# Altium schematic sheet Control.SchDoc
size 406 x 304 mm; SheetNumber: 4; SheetTotal: 8
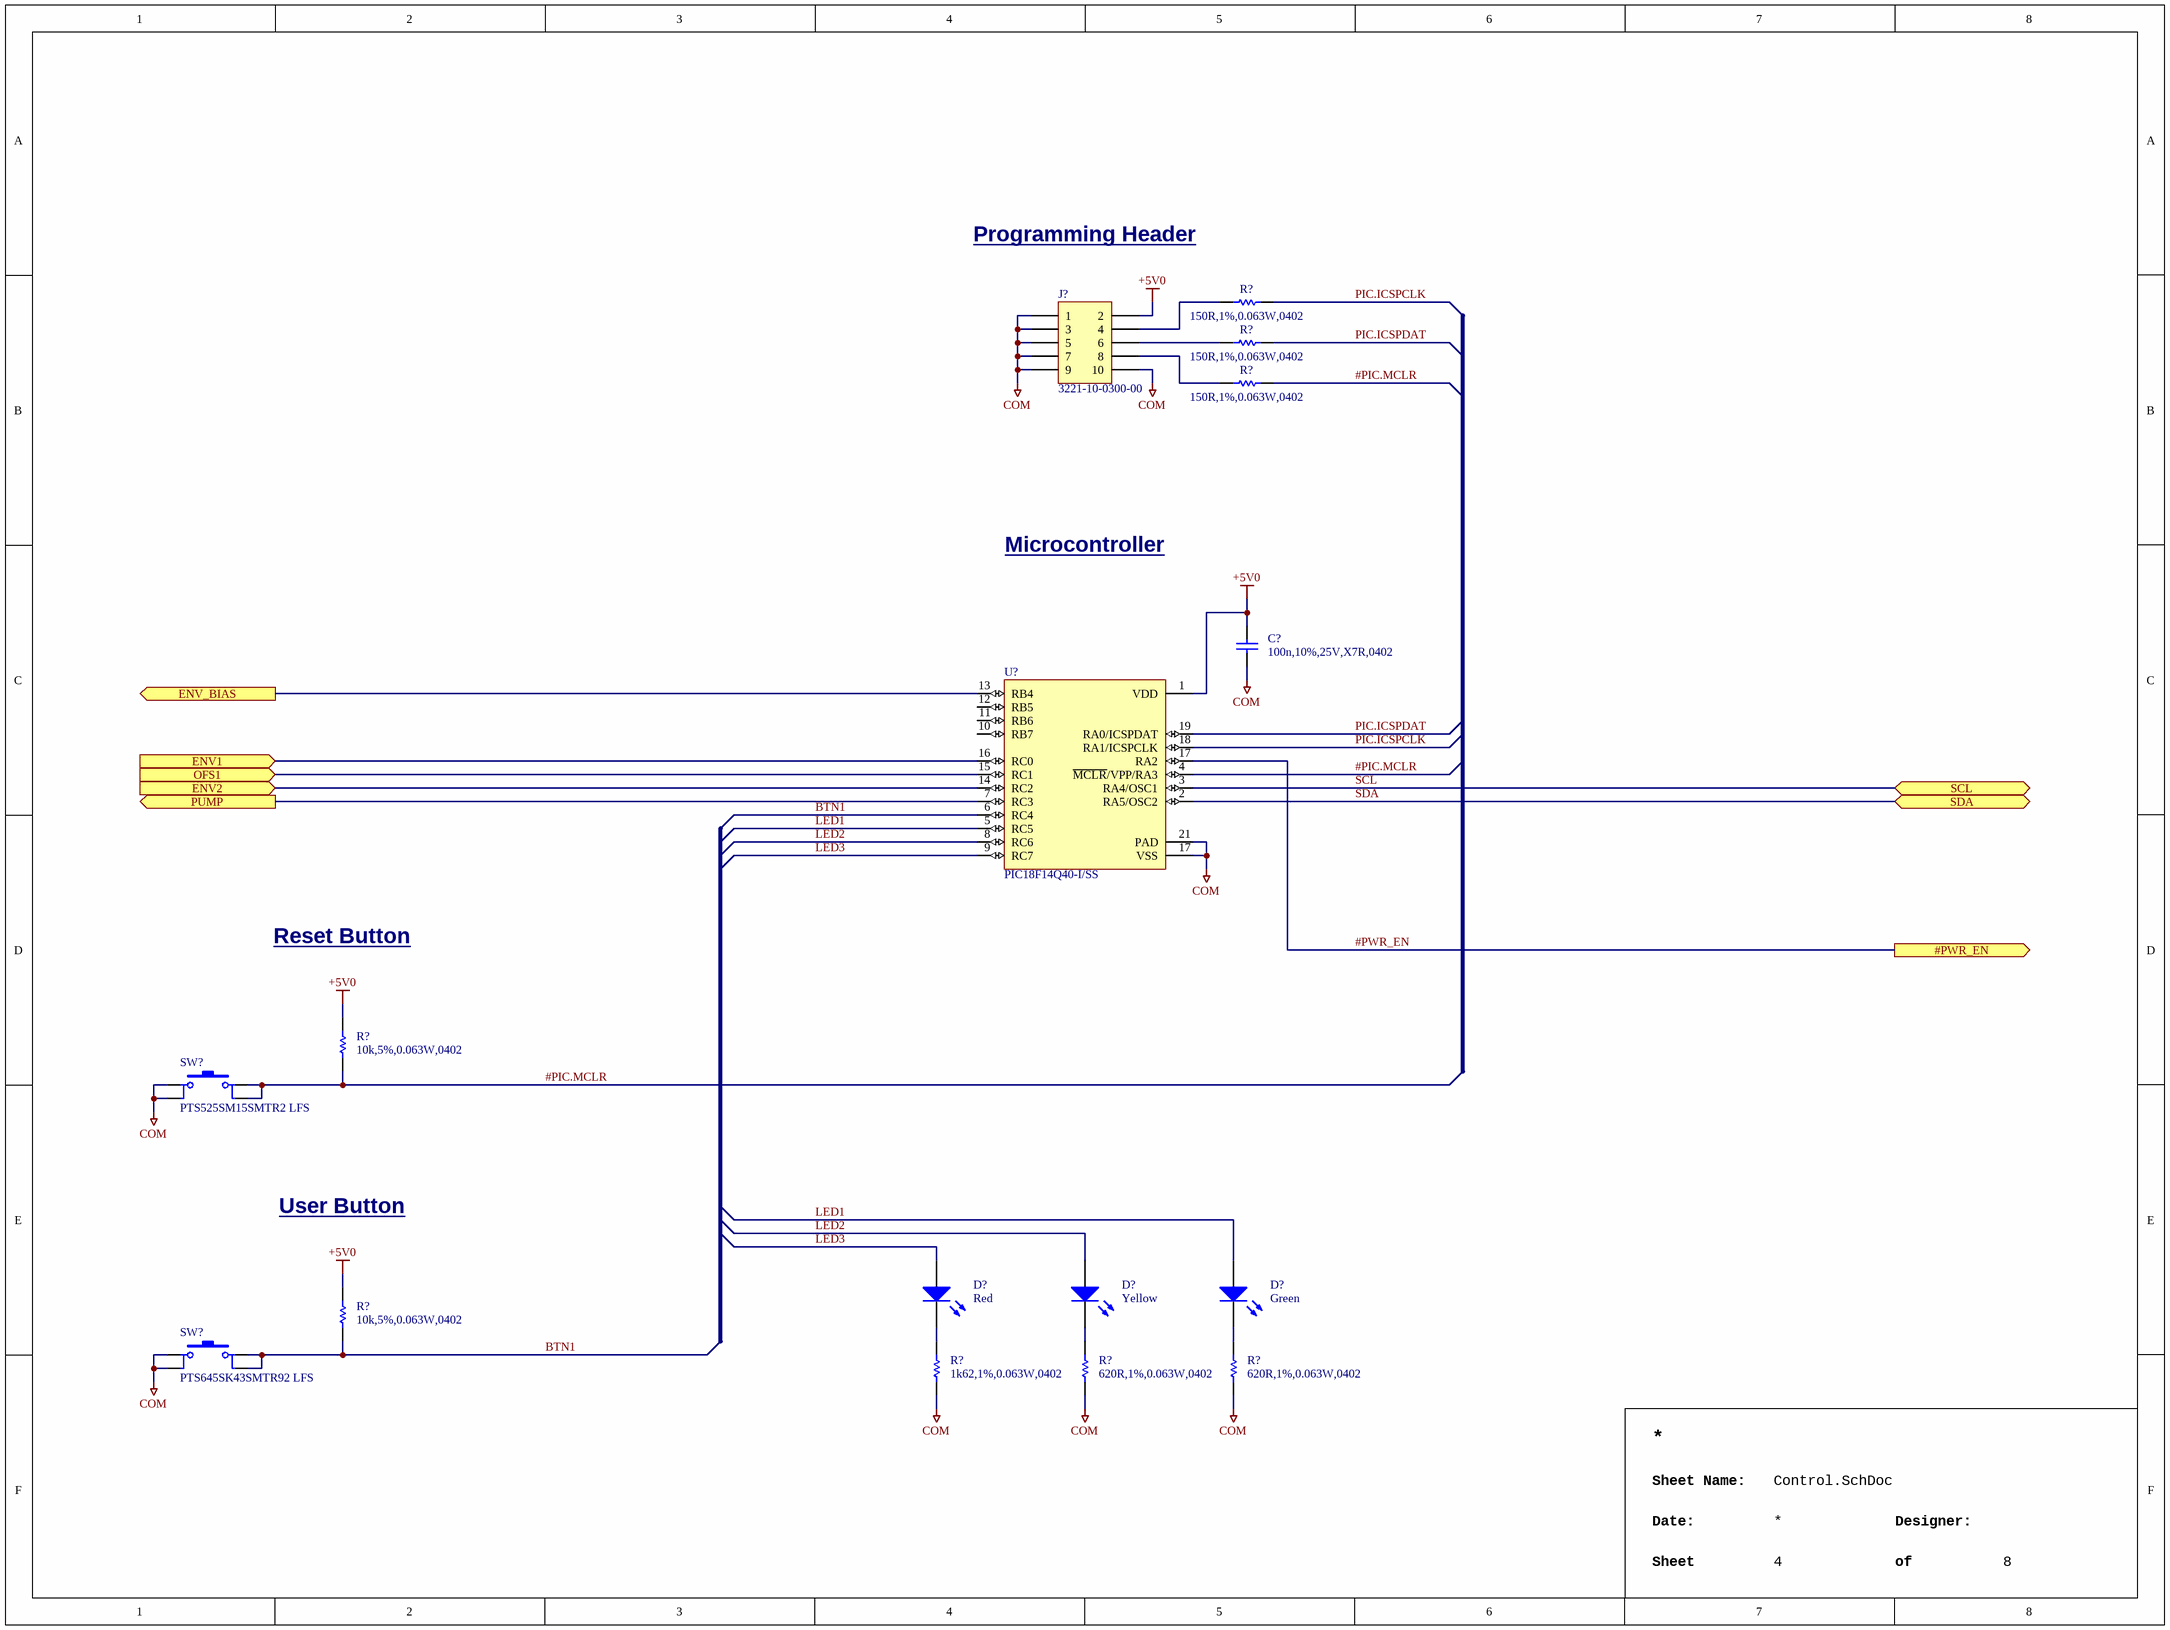
[diagram p0: Control.SchDoc]

## Parts
(Parts that share a designator on the sheet are numbered #1, #2 ... from top to bottom, then left to right.)
C?  100n,10%,25V,X7R,0402  [CAPC1005X06N]
D?#1  Red  [LITE-ON_LTST-C190KRKT]
D?#2  Yellow  [LITE-ON_LTST-C190KSKT]
D?#3  Green  [LITE-ON_LTST-C190KGKT]
J?  3221-10-0300-00  [CNC Tech_3221-10-0300-00]
R?#1  150R,1%,0.063W,0402  [RESC1005X04N]
R?#2  150R,1%,0.063W,0402  [RESC1005X04N]
R?#3  150R,1%,0.063W,0402  [RESC1005X04N]
R?#4  10k,5%,0.063W,0402  [RESC1005X04N]
R?#5  10k,5%,0.063W,0402  [RESC1005X04N]
R?#6  1k62,1%,0.063W,0402  [RESC1005X04N]
R?#7  620R,1%,0.063W,0402  [RESC1005X04N]
R?#8  620R,1%,0.063W,0402  [RESC1005X04N]
SW?#1  PTS525SM15SMTR2 LFS  [C&K_PTS525SM15SMTR2 LFS]
SW?#2  PTS645SK43SMTR92 LFS  [C&K_PTS645SK43SMTR92 LFS]
U?  PIC18F14Q40-I/SS  [MICROCHIP_PKG_SSOP20(C04-2072B)]

## Ports
#PWR_EN (out), ENV1 (in), ENV2 (in), ENV_BIAS (out), OFS1 (in), PUMP (out), SCL (bidir), SDA (bidir)

## Nets
+5V0: C?.2 J?.2 R?#4.2 R?#5.2 U?.1(VDD)
COM: C?.1 J?.1 J?.3 J?.5 J?.7 J?.9 J?.10 R?#6.1 R?#7.1 R?#8.1 SW?#1.1 SW?#1.2 SW?#2.1 SW?#2.2 U?.17(VSS) U?.21(PAD)
#PIC.MCLR: R?#3.2 R?#4.1 SW?#1.3 SW?#1.4 U?.4(~{MCLR}/VPP/RA3)
#PWR_EN: U?.17(RA2) ; port #PWR_EN
BTN1: R?#5.1 SW?#2.3 SW?#2.4 U?.6(RC4)
ENV1: U?.16(RC0) ; port ENV1
ENV2: U?.14(RC2) ; port ENV2
ENV_BIAS: U?.13(RB4) ; port ENV_BIAS
LED1: D?#3.A U?.5(RC5)
LED2: D?#2.A U?.8(RC6)
LED3: D?#1.A U?.9(RC7)
OFS1: U?.15(RC1) ; port OFS1
PIC.ICSPCLK: R?#1.2 U?.18(RA1/ICSPCLK)
PIC.ICSPDAT: R?#2.2 U?.19(RA0/ICSPDAT)
PUMP: U?.7(RC3) ; port PUMP
SCL: U?.3(RA4/OSC1) ; port SCL
SDA: U?.2(RA5/OSC2) ; port SDA
NetD?#1_C: D?#1.C R?#6.2
NetD?#2_C: D?#2.C R?#7.2
NetD?#3_C: D?#3.C R?#8.2
NetJ?_4: J?.4 R?#1.1
NetJ?_6: J?.6 R?#2.1
NetJ?_8: J?.8 R?#3.1

Not connected (* = marked no-connect by the designer): U? 10(RB7) 11(RB6) 12(RB5)

## Notes on the sheet
- Programming Header
- Microcontroller
- Reset Button
- User Button
- Sheet Name:
- Date:
- Sheet
- Designer:
- of

## Library data of the parts
C? = CAP,Cer,100nF,10%,25V,X7R,0402: 0.1ï¿½F ï¿½10% 25V Ceramic Capacitor X7R 0402 (1005 Metric); Manufacturer 1: Murata Electronics; Manufacturer 1 Part Number: GRM155R71E104KE14J; Vendor 1 Part Number: 490-14603-1-ND; Vendor 1: DigiKey; Value: 100nF; Part Name: CAP,Cer,100nF,10%,25V,X7R,0402; CreatedBy: Judd Foster; HelpURL: https://search.murata.co.jp/Ceramy/image/img/A01X/G101/ENG/GRM155R71E104KE14-01.pdf
D?#1 = LED,Red,SMD,0603: Red 631nm LED Indication - Discrete 2V 0603 (1608 Metric); Manufacturer 1: Lite-On Inc.; Manufacturer 1 Part Number: LTST-C190KRKT; Vendor 1 Part Number: 160-1436-1-ND; Vendor 1: Digikey; Part Name: LED,Red,SMD,0603; CreatedBy: Judd Foster; HelpURL: https://optoelectronics.liteon.com/upload/download/DS-22-99-0151/LTST-C190KRKT.pdf; Value: Red
D?#2 = LED,Yellow,SMD,0603: Yellow 591nm LED Indication - Discrete 2.1V 0603 (1608 Metric); Manufacturer 1: Lite-On Inc.; Manufacturer 1 Part Number: LTST-C190KSKT; Vendor 1 Part Number: 160-1437-1-ND; Vendor 1: Digikey; Part Name: LED,Yellow,SMD,0603; CreatedBy: Judd Foster; HelpURL: https://optoelectronics.liteon.com/upload/download/DS-22-99-0189/LTST-C190KSKT.pdf; Value: Yellow
D?#3 = LED,Green,SMD,0603: Green 571nm LED Indication - Discrete 2V 0603 (1608 Metric); Manufacturer 1: Lite-On Inc.; Manufacturer 1 Part Number: LTST-C190KGKT; Vendor 1 Part Number: 160-1435-1-ND; Vendor 1: Digikey; Part Name: LED,Green,SMD,0603; CreatedBy: Judd Foster; HelpURL: https://optoelectronics.liteon.com/upload/download/DS22-2000-074/LTST-C190KGKT.PDF; Value: Green
J? = Term,Header,5x2 Pin,Shroud,1.27mm,SMD: Connector Header Surface Mount 10 position 0.050" (1.27mm); Manufacturer 1: CNC Tech; Vendor 1 Part Number: 1175-1735-ND; Vendor 1: Digikey; Part Name: Term,Header,5x2 Pin,Shroud,1.27mm,SMD; CreatedBy: Judd Foster; HelpURL: http://www.cnctech.us/pdfs/3221-XX-0300-00_.pdf; Manufacturer 1 Part Number: 3221-10-0300-00
R?#1-R?#3 = RES,150R,1%,0.1W,0402: 150 Ohms ï¿½1% 0.063W, 1/16W Chip Resistor 0402 (1005 Metric) Automotive AEC-Q200, Moisture Resistant Thick Film; Manufacturer 1: TE Connectivity Passive Product; Manufacturer 1 Part Number: CRGCQ0402F150R; Vendor 1 Part Number: A129617CT-ND; Vendor 1: Digikey; Part Name: RES,150R,1%,0.1W,0402; CreatedBy: Judd Foster; HelpURL: https://www.te.com/commerce/DocumentDelivery/DDEController?Action=srchrtrv&DocNm=1773204-3&DocType=DS&DocLang=English; Value: 150R
R?#4 R?#5 = RES,10k,5%,0.063W,0402: 10 kOhms ï¿½5% 0.063W, 1/16W Chip Resistor 0402 (1005 Metric) Automotive AEC-Q200 Thick Film; Manufacturer 1: Stackpole Electronics Inc; Manufacturer 1 Part Number: RMCF0402JT10K0; Vendor 1 Part Number: RMCF0402JT10K0CT-ND; Vendor 1: DIgikey; Part Name: RES,10k,5%,0.063W,0402; CreatedBy: Judd Foster; HelpURL: https://www.seielect.com/catalog/sei-rmcf_rmcp.pdf; Value: 10k
R?#6 = RES,1k62,1%,0.063W,0402: 1.62 kOhms Â±1% 0.063W, 1/16W Chip Resistor 0402 (1005 Metric) Moisture Resistant Thick Film; Manufacturer 1: YAGEO; Manufacturer 1 Part Number: RC0402FR-071K62L; Vendor 1 Part Number: YAG3042CT-ND; Vendor 1: DigiKey; Part Name: RES,1k62,1%,0.063W,0402; CreatedBy: Judd Foster; HelpURL: https://www.yageo.com/upload/media/product/products/datasheet/rchip/PYu-RC_Group_51_RoHS_L_12.pdf; Value: 1k62
R?#7 R?#8 = RES,620R,1%,0.063W,0402: 620 Ohms Â±1% 0.063W, 1/16W Chip Resistor 0402 (1005 Metric) Thin Film; Manufacturer 1: YAGEO; Manufacturer 1 Part Number: RT0402FRE07620RL; Vendor 1 Part Number: 13-RT0402FRE07620RLCT-ND; Vendor 1: DigiKey; Part Name: RES,620R,1%,0.063W,0402; CreatedBy: Judd Foster; HelpURL: https://www.yageo.com/upload/media/product/app/datasheet/rchip/pyu-rt_1-to-0.01_rohs_l.pdf; Value: 620R
SW?#1 = Switch,Tactile,SPST-NO,SMD,H1.5: Tactile Switch SPST-NO Top Actuated Surface Mount; Manufacturer 1: C&K; Vendor 1 Part Number: CKN9104CT-ND; Vendor 1: Digikey; Part Name: Switch,Tactile,SPST-NO,SMD,H1.5; CreatedBy: Judd Foster; HelpURL: https://www.ckswitches.com/media/1467/pts525.pdf; Manufacturer 1 Part Number: PTS525SM15SMTR2 LFS
SW?#2 = Switch,Tactile,SPST-NO,SMD,H4.3: Tactile Switch SPST-NO Top Actuated Surface Mount; Manufacturer 1: C&K; Vendor 1 Part Number: CKN9084CT-ND; Vendor 1: Digikey; Part Name: Switch,Tactile,SPST-NO,SMD,H4.3; CreatedBy: Judd Foster; HelpURL: https://www.ckswitches.com/media/1471/pts645.pdf; Manufacturer 1 Part Number: PTS645SK43SMTR92 LFS
U? = PIC18F14Q40-I_SS: PIC PICÂ® 18F Microcontroller IC 8-Bit 64MHz 16KB (16K x 8) FLASH 20-SSOP; Manufacturer 1: Microchip Technology; Vendor 1 Part Number: 150-PIC18F14Q40-I/SS-ND; Vendor 1: DigiKey; Part Name: PIC18F14Q40-I_SS; CreatedBy: Judd Foster; HelpURL: https://ww1.microchip.com/downloads/en/DeviceDoc/PIC18F04-05-14-15-Q40-1420-Pin-Low-Power-High-Performance-Microcontroller-With-XLP-Technology-Data-Sheet-40002236B.pdf; Manufacturer 1 Part Number: PIC18F14Q40-I/SS